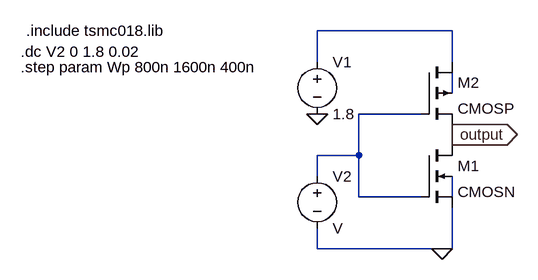
[diagram p0: schematic cmosinverterdcsweepwithvaryingWp.asc]
cmosinverterdcsweepwithvaryingWp.asc, the LTspice schematic file:
Version 4
SHEET 1 880 680
WIRE 192 -112 -16 -112
WIRE -16 -64 -16 -112
WIRE 192 -64 192 -112
WIRE 192 -16 192 -48
WIRE 144 16 48 16
WIRE 192 48 192 32
WIRE 192 64 192 48
WIRE 48 80 48 16
WIRE 48 80 -16 80
WIRE -16 112 -16 80
WIRE 48 144 48 80
WIRE 144 144 48 144
WIRE 192 144 192 112
WIRE 192 144 176 144
WIRE -16 224 -16 192
WIRE 176 224 -16 224
WIRE 192 224 192 160
WIRE 192 224 176 224
FLAG -16 16 0
FLAG 176 224 0
FLAG 192 48 output
IOPIN 192 48 Out
SYMBOL cmosn 144 64 R0
SYMATTR InstName M1
SYMATTR Value2 l=180n w=400n
SYMBOL cmosp 144 -64 R0
SYMATTR InstName M2
SYMATTR Value2 l=180n w=Wp
SYMBOL voltage -16 -80 R0
WINDOW 123 0 0 Left 0
WINDOW 39 0 0 Left 0
SYMATTR InstName V1
SYMATTR Value 1.8
SYMBOL voltage -16 96 R0
SYMATTR InstName V2
TEXT -472 -80 Left 2 !.dc V2 0 1.8 0.02
TEXT -472 -56 Left 2 !.step param Wp 800n 1600n 400n
TEXT -464 -112 Left 2 !.include tsmc018.lib

The netlist it stands for:
* cmosinverterdcsweepwithvaryingWp.asc
M1 output N003 0 N004 CMOSN l=180n w=400n
M2 N001 N003 output N002 CMOSP l=180n w=Wp
V1 N001 0 1.8
V2 N003 0 V
.model NMOS NMOS
.model PMOS PMOS
.lib standard.mos
.dc V2 0 1.8 0.02
.step param Wp 800n 1600n 400n
.include tsmc018.lib
.backanno
.end